# Altium schematic sheet ADC.SchDoc
size A; SheetNumber: 3; SheetTotal: 5
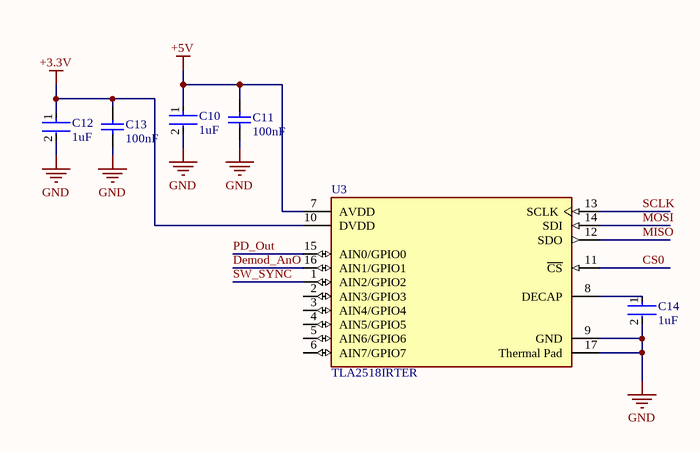
[diagram p0: ADC.SchDoc]

## Parts
C10  1uF  [FP-CL542-IPC_C]
C11  100nF  [CAPC1050X55X23ML05T13]
C12  1uF  [FP-CL542-IPC_C]
C13  100nF  [CAPC1050X55X23ML05T13]
C14  1uF  [FP-CL542-IPC_C]
U3  TLA2518IRTER  [FP-RTE0016C-MFG]

## Nets
+3.3V: C12.1 C13.2 U3.10(DVDD)
+5V: C10.1 C11.2 U3.7(AVDD)
GND: C10.2 C11.1 C12.2 C13.1 C14.2 U3.9(GND) U3.17(Thermal_Pad)
CS0: U3.11(~{CS})
Demod_AnO: U3.16(AIN1/GPIO1)
MISO: U3.12(SDO)
MOSI: U3.14(SDI)
PD_Out: U3.15(AIN0/GPIO0)
SCLK: U3.13(SCLK)
SW_SYNC: U3.1(AIN2/GPIO2)
NetC14_1: C14.1 U3.8(DECAP)

Not connected (* = marked no-connect by the designer): U3 2(AIN3/GPIO3) 3(AIN4/GPIO4) 4(AIN5/GPIO5) 5(AIN6/GPIO6) 6(AIN7/GPIO7)

## Library data of the parts
C10 C12 C14 = CMP-13271-001051-1: Cap Ceramic 1uF 25V X5R ±10% SMD 0402 +85°C Paper T/R; Radiation Hardening: No; Lead Free: Lead Free; Capacitance: 1uF; Package Quantity: 10000; Max Operating Temperature: 85°C; Voltage Rating: 25V; Case/Package: 0402; Min Operating Temperature: -55°C; Packaging: Tape and Reel; Tolerance: 10%; Height: 0.5mm; Thickness: 0.022inch; Case Code (Metric): 1005; Width: 0.02inch; Case Code (Imperial): 0402; Dielectric: X5R; Length: 1mm; Mount: Surface Mount; Material: Ceramic; Depth: 0.5mm
C11 C13 = CMP-2000-05439-1: Chip Capacitor, 100 nF, +/- 10%, 16 V, -55 to 125 degC, 0402 (1005 Metric), RoHS, Tape and Reel; Manufacturer: Samsung Electro-Mechanics; Capacitance: 100000pF; Dielectric: X7R; Rated Voltage: 16V; Case Size/Dimension: 0402; Tolerance (%): ±10%; Manufacturer URL: http://www.samsungsem.com/global/index.jsp; Datasheet URL: https://datasheet.ciiva.com/29198/458718-da-01-en-vs-kondensator-0402-29198423.pdf; Datasheet Version: Nov-10
U3 = CMP-04860-000058-1: IC ADC 12BIT SAR 16WQFN